# Altium schematic sheet Clk.SchDoc
size A4
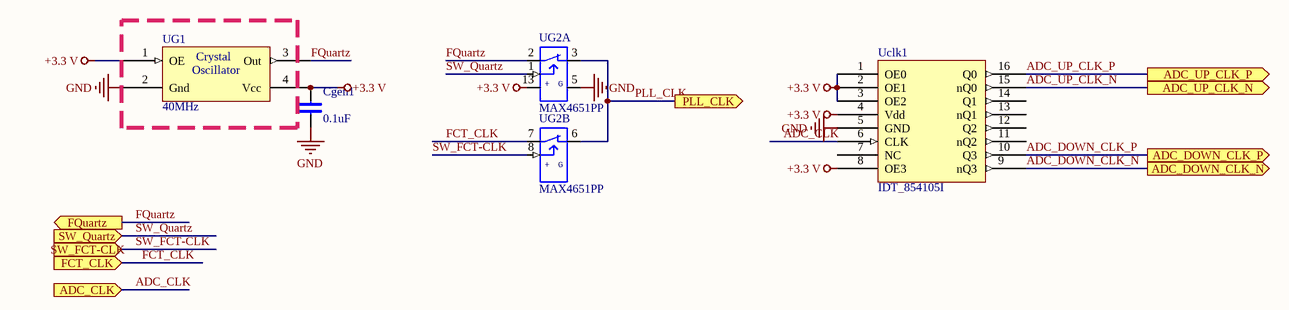
[diagram p0: Clk.SchDoc]

## Parts
Cgen1  0.1uF  [chip0603]
Uclk1  IDT_854105I  [TSSOP16]
UG1  40MHz  [SG 5*3.2]
UG2  MAX4651PP  [16SOIC150]  (parts A,B of 4)

## Ports
ADC_CLK (in), ADC_DOWN_CLK_N (out), ADC_DOWN_CLK_P (out), ADC_UP_CLK_N (out), ADC_UP_CLK_P (out), FCT_CLK (in), FQuartz (out), PLL_CLK (out), SW_FCT-CLK (in), SW_Quartz (in)

## Nets
+3.3 V: Cgen1.2 Uclk1.1(OE0) Uclk1.2(OE1) Uclk1.3(OE2) Uclk1.4(Vdd) Uclk1.8(OE3) UG1.1(OE) UG1.4(Vcc) UG2.13(VCC)
GND: Cgen1.1 Uclk1.5(GND) UG1.2(Gnd) UG2.5(GND)
ADC_CLK: Uclk1.6(CLK) ; port ADC_CLK
ADC_DOWN_CLK_N: Uclk1.9(nQ3) ; port ADC_DOWN_CLK_N
ADC_DOWN_CLK_P: Uclk1.10(Q3) ; port ADC_DOWN_CLK_P
ADC_UP_CLK_N: Uclk1.15(nQ0) ; port ADC_UP_CLK_N
ADC_UP_CLK_P: Uclk1.16(Q0) ; port ADC_UP_CLK_P
FCT_CLK: UG2.7(IN) ; port FCT_CLK
FQuartz: UG1.3(Out) UG2.2(IN) ; port FQuartz
PLL_CLK: UG2.3(OUT) UG2.6(OUT) ; port PLL_CLK
SW_FCT-CLK: UG2.8(CONTROL) ; port SW_FCT-CLK
SW_Quartz: UG2.1(CONTROL) ; port SW_Quartz

Not connected (* = marked no-connect by the designer): Uclk1 7(NC) 11(nQ2) 12(Q2) 13(nQ1) 14(Q1)

## Notes on the sheet
- (in symbol MAX4651PP, part A) +; G
- (in symbol MAX4651PP, part B) +; G
- (in symbol SG-636) Crystal; Oscillator

## Library data of the parts
Cgen1 = C: Text Field1: 20; Text Field2: 10
UG1 = SG-636: Crystal Oscillator (SMD)
UG2 = MAX4651PP: Text Field1: 20; Text Field2: 40